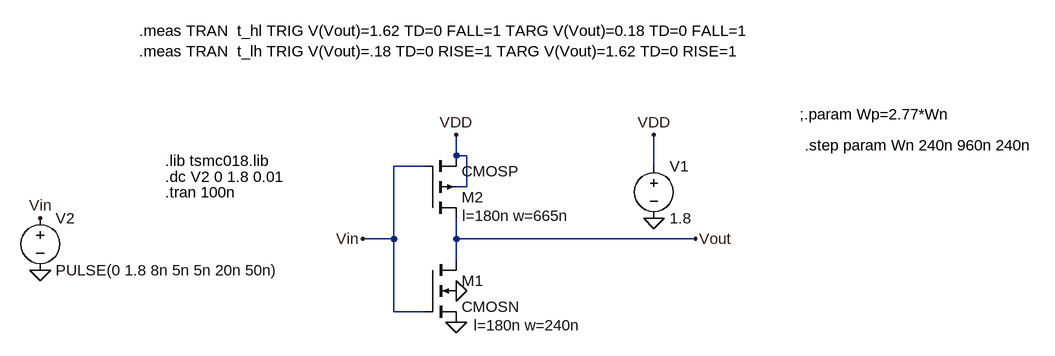
[diagram p0: schematic Draft2.asc]
Draft2.asc, the LTspice schematic file:
Version 4
SHEET 1 1136 680
WIRE 208 16 208 -16
WIRE 224 16 208 16
WIRE 160 32 112 32
WIRE 512 32 512 -16
WIRE 224 64 224 16
WIRE 224 64 208 64
WIRE 112 144 112 32
WIRE 112 144 64 144
WIRE 208 144 208 112
WIRE 576 144 208 144
WIRE 208 176 208 144
WIRE 112 256 112 144
WIRE 160 256 112 256
FLAG 208 224 0
FLAG 208 272 0
FLAG 512 112 0
FLAG 512 -16 VDD
FLAG -432 192 0
FLAG -432 112 Vin
FLAG 64 144 Vin
FLAG 208 -16 VDD
FLAG 576 144 Vout
SYMBOL nmos4 160 176 R0
WINDOW 123 75 101 Left 2
SYMATTR Value2 l=180n w=240n
SYMATTR InstName M1
SYMATTR Value CMOSN
SYMBOL pmos4 160 112 M180
WINDOW 123 57 4 Left 2
SYMATTR Value2 l=180n w=665n
SYMATTR InstName M2
SYMATTR Value CMOSP
SYMBOL voltage 512 16 R0
WINDOW 123 0 0 Left 0
WINDOW 39 0 0 Left 0
SYMATTR InstName V1
SYMATTR Value 1.8
SYMBOL voltage -432 96 R0
WINDOW 123 0 0 Left 0
WINDOW 39 0 0 Left 0
SYMATTR InstName V2
SYMATTR Value PULSE(0 1.8 8n 5n 5n 20n 50n)
TEXT -240 24 Left 2 !.lib tsmc018.lib
TEXT -240 48 Left 2 !.dc V2 0 1.8 0.01
TEXT -240 72 Left 2 !.tran 100n
TEXT -280 -176 Left 2 !.meas TRAN  t_hl TRIG V(Vout)=1.62 TD=0 FALL=1 TARG V(Vout)=0.18 TD=0 FALL=1\n.meas TRAN  t_lh TRIG V(Vout)=.18 TD=0 RISE=1 TARG V(Vout)=1.62 TD=0 RISE=1
TEXT 736 -48 Left 2 !;.param Wp=2.77*Wn
TEXT 744 0 Left 2 !.step param Wn 240n 960n 240n

The netlist it stands for:
* Draft2.asc
M1 Vout Vin 0 0 CMOSN l=180n w=240n
M2 Vout Vin VDD VDD CMOSP l=180n w=665n
V1 VDD 0 1.8
V2 Vin 0 PULSE(0 1.8 8n 5n 5n 20n 50n)
.model NMOS NMOS
.model PMOS PMOS
.lib standard.mos
.lib tsmc018.lib
.dc V2 0 1.8 0.01
.tran 100n
.meas TRAN  t_hl TRIG V(Vout)=1.62 TD=0 FALL=1 TARG V(Vout)=0.18 TD=0 FALL=1
.meas TRAN  t_lh TRIG V(Vout)=.18 TD=0 RISE=1 TARG V(Vout)=1.62 TD=0 RISE=1
;.param Wp=2.77*Wn
.step param Wn 240n 960n 240n
.backanno
.end

* Results of the author's LTspice run, read from the files saved beside the schematic
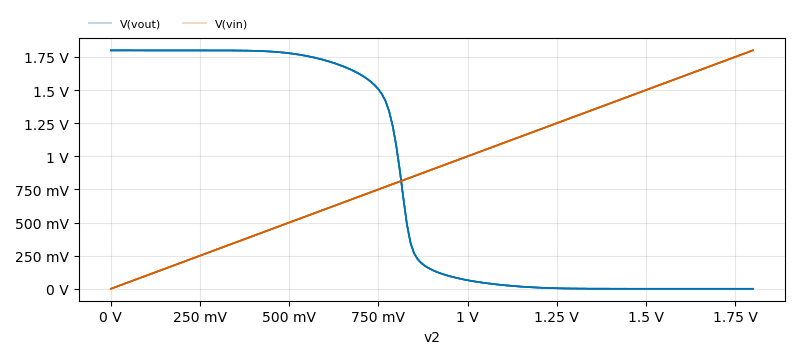
[diagram p1: DC transfer characteristic of Draft2.asc, plotted from the saved traces]
* DC transfer characteristic, 4 runs:
*   V(vout) [wn=2.4e-07]: 1.8 V at v2=0 V, 10.78 nV at v2=1.8 V, min 10.78 nV, max 1.8 V
*   V(vout) [wn=4.8e-07]: 1.8 V at v2=0 V, 10.78 nV at v2=1.8 V, min 10.78 nV, max 1.8 V
*   V(vout) [wn=7.2e-07]: 1.8 V at v2=0 V, 10.78 nV at v2=1.8 V, min 10.78 nV, max 1.8 V
*   V(vout) [wn=9.6e-07]: 1.8 V at v2=0 V, 10.78 nV at v2=1.8 V, min 10.78 nV, max 1.8 V
*   V(vin) [wn=2.4e-07]: 0 V at v2=0 V, 1.8 V at v2=1.8 V, min 0 V, max 1.8 V
*   V(vin) [wn=4.8e-07]: 0 V at v2=0 V, 1.8 V at v2=1.8 V, min 0 V, max 1.8 V
*   V(vin) [wn=7.2e-07]: 0 V at v2=0 V, 1.8 V at v2=1.8 V, min 0 V, max 1.8 V
*   V(vin) [wn=9.6e-07]: 0 V at v2=0 V, 1.8 V at v2=1.8 V, min 0 V, max 1.8 V